# Altium schematic sheet 470 ohm.schdoc
size 127 x 99 mm
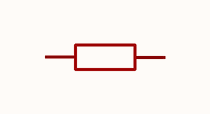
[diagram p0: 470 ohm.schdoc]

## Parts
R?  470Ω  [R0402]  (value not drawn)

## Nets

Not connected (* = marked no-connect by the designer): R? 1 2

## Library data of the parts
R? = CR0402FF4700G: Manufacturer: LIZ(丽智电子); Add into BOM: yes; Tolerance: ±1%; Temperature Coefficient: ±200ppm/℃; Symbol: CR0402FF4700G; Device: CR0402FF4700G; LCSC Part Name: 厚膜电阻 470Ω ±1% 62.5mW; Supplier Part: C100443; Manufacturer Part: CR0402FF4700G; Supplier Footprint: 0402; JLCPCB Part Class: Extended Part; Datasheet: https://atta.szlcsc.com/upload/public/pdf/source/20180403/C189438_6D658388CC7843F35BBC9018D03F0B8E.pdf; Supplier: LCSC; Convert to PCB: yes; Type: Thick Film Resistors; Value: 470Ω; Operating Temperature Range: -55℃~+125℃